# Altium schematic sheet main_stack_dual_channel.SchDoc
size A
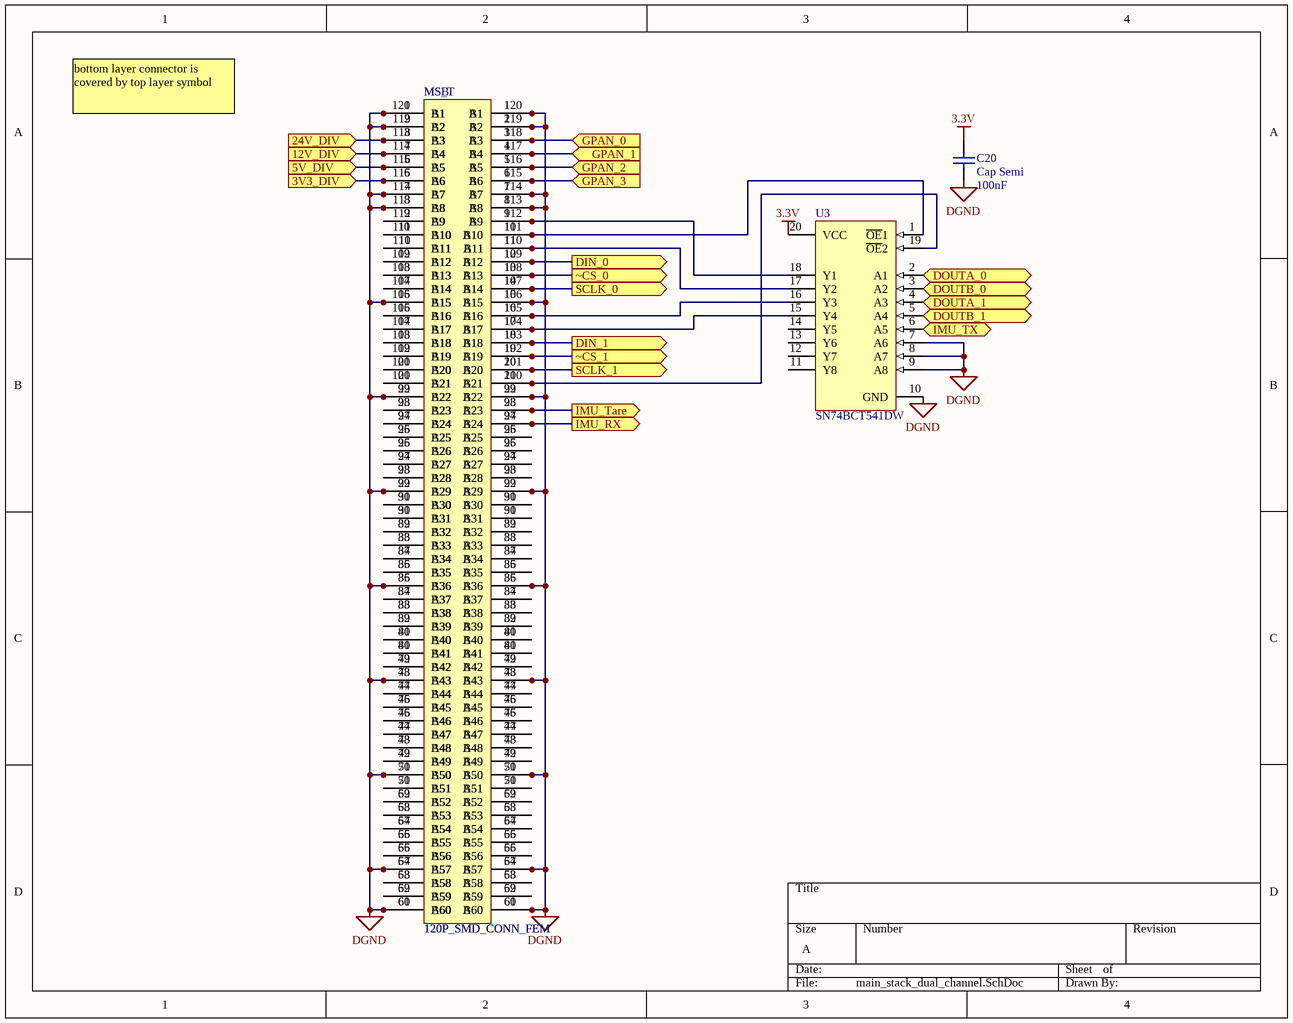
[diagram p0: main_stack_dual_channel.SchDoc]

## Parts
C20  Cap Semi  value 100nF  [C0805]
MS_T  120P_SMD_CONN_FEM  [FX2-120P-1.27SV]
MSB  120P_SMD_CONN_FEM  [FX2-120P-1.27SV]
U3  SN74BCT541DW  [DW020]

## Ports
3V3_DIV (in), 5V_DIV (in), 12V_DIV (in), 24V_DIV (in), DIN_0 (out), DIN_1 (out), DOUTA_0 (in), DOUTA_1 (in), DOUTB_0 (in), DOUTB_1 (in), GPAN_0 (in), GPAN_1 (in), GPAN_2 (in), GPAN_3 (in), IMU_RX (out), IMU_Tare (out), IMU_TX (in), SCLK_0 (out), SCLK_1 (out), ~CS_0 (out), ~CS_1 (out)

## Nets
3.3V: C20.2 U3.20(VCC)
DGND: C20.1 MS_T.1(A1) MS_T.2(A2) MS_T.7(A7) MS_T.8(A8) MS_T.15(A15) MS_T.22(A22) MS_T.29(A29) MS_T.36(A36) MS_T.43(A43) MS_T.50(A50) MS_T.57(A57) MS_T.60(A60) MS_T.61(B60) MS_T.64(B57) MS_T.71(B50) MS_T.78(B43) MS_T.85(B36) MS_T.92(B29) MS_T.99(B22) MS_T.106(B15) MS_T.113(B8) MS_T.114(B7) MS_T.119(B2) MS_T.120(B1) MSB.1(A1) MSB.2(A2) MSB.7(A7) MSB.8(A8) MSB.15(A15) MSB.22(A22) MSB.29(A29) MSB.36(A36) MSB.43(A43) MSB.50(A50) MSB.57(A57) MSB.60(A60) MSB.61(B60) MSB.64(B57) MSB.71(B50) MSB.78(B43) MSB.85(B36) MSB.92(B29) MSB.99(B22) MSB.106(B15) MSB.113(B8) MSB.114(B7) MSB.119(B2) MSB.120(B1) U3.7(A6) U3.8(A7) U3.9(A8) U3.10(GND)
3V3_DIV: MS_T.6(A6) MSB.115(B6) ; port 3V3_DIV
5V_DIV: MS_T.5(A5) MSB.116(B5) ; port 5V_DIV
12V_DIV: MS_T.4(A4) MSB.117(B4) ; port 12V_DIV
24V_DIV: MS_T.3(A3) MSB.118(B3) ; port 24V_DIV
DIN_0: MS_T.109(B12) MSB.12(A12) ; port DIN_0
DIN_1: MS_T.103(B18) MSB.18(A18) ; port DIN_1
DOUTA_0: U3.2(A1) ; port DOUTA_0
DOUTA_1: U3.4(A3) ; port DOUTA_1
DOUTB_0: U3.3(A2) ; port DOUTB_0
DOUTB_1: U3.5(A4) ; port DOUTB_1
GPAN_0: MS_T.118(B3) MSB.3(A3) ; port GPAN_0
GPAN_1: MS_T.117(B4) MSB.4(A4) ; port GPAN_1
GPAN_2: MS_T.116(B5) MSB.5(A5) ; port GPAN_2
GPAN_3: MS_T.115(B6) MSB.6(A6) ; port GPAN_3
IMU_RX: MS_T.97(B24) MSB.24(A24) ; port IMU_RX
IMU_Tare: MS_T.98(B23) MSB.23(A23) ; port IMU_Tare
IMU_TX: U3.6(A5) ; port IMU_TX
SCLK_0: MS_T.107(B14) MSB.14(A14) ; port SCLK_0
SCLK_1: MS_T.101(B20) MSB.20(A20) ; port SCLK_1
~CS_0: MS_T.108(B13) MSB.13(A13) ; port ~CS_0
~CS_1: MS_T.102(B19) MSB.19(A19) ; port ~CS_1
NetMS_T_9: MS_T.9(A9) MSB.112(B9)
NetMS_T_10: MS_T.10(A10) MSB.111(B10)
NetMS_T_11: MS_T.11(A11) MSB.110(B11)
NetMS_T_12: MS_T.12(A12) MSB.109(B12)
NetMS_T_13: MS_T.13(A13) MSB.108(B13)
NetMS_T_14: MS_T.14(A14) MSB.107(B14)
NetMS_T_16: MS_T.16(A16) MSB.105(B16)
NetMS_T_17: MS_T.17(A17) MSB.104(B17)
NetMS_T_18: MS_T.18(A18) MSB.103(B18)
NetMS_T_19: MS_T.19(A19) MSB.102(B19)
NetMS_T_20: MS_T.20(A20) MSB.101(B20)
NetMS_T_21: MS_T.21(A21) MSB.100(B21)
NetMS_T_23: MS_T.23(A23) MSB.98(B23)
NetMS_T_24: MS_T.24(A24) MSB.97(B24)
NetMS_T_25: MS_T.25(A25) MSB.96(B25)
NetMS_T_26: MS_T.26(A26) MSB.95(B26)
NetMS_T_27: MS_T.27(A27) MSB.94(B27)
NetMS_T_28: MS_T.28(A28) MSB.93(B28)
NetMS_T_30: MS_T.30(A30) MSB.91(B30)
NetMS_T_31: MS_T.31(A31) MSB.90(B31)
NetMS_T_32: MS_T.32(A32) MSB.89(B32)
NetMS_T_33: MS_T.33(A33) MSB.88(B33)
NetMS_T_34: MS_T.34(A34) MSB.87(B34)
NetMS_T_35: MS_T.35(A35) MSB.86(B35)
NetMS_T_37: MS_T.37(A37) MSB.84(B37)
NetMS_T_38: MS_T.38(A38) MSB.83(B38)
NetMS_T_39: MS_T.39(A39) MSB.82(B39)
NetMS_T_40: MS_T.40(A40) MSB.81(B40)
NetMS_T_41: MS_T.41(A41) MSB.80(B41)
NetMS_T_42: MS_T.42(A42) MSB.79(B42)
NetMS_T_44: MS_T.44(A44) MSB.77(B44)
NetMS_T_45: MS_T.45(A45) MSB.76(B45)
NetMS_T_46: MS_T.46(A46) MSB.75(B46)
NetMS_T_47: MS_T.47(A47) MSB.74(B47)
NetMS_T_48: MS_T.48(A48) MSB.73(B48)
NetMS_T_49: MS_T.49(A49) MSB.72(B49)
NetMS_T_51: MS_T.51(A51) MSB.70(B51)
NetMS_T_52: MS_T.52(A52) MSB.69(B52)
NetMS_T_53: MS_T.53(A53) MSB.68(B53)
NetMS_T_54: MS_T.54(A54) MSB.67(B54)
NetMS_T_55: MS_T.55(A55) MSB.66(B55)
NetMS_T_56: MS_T.56(A56) MSB.65(B56)
NetMS_T_58: MS_T.58(A58) MSB.63(B58)
NetMS_T_59: MS_T.59(A59) MSB.62(B59)
NetMS_T_62: MS_T.62(B59) MSB.59(A59)
NetMS_T_63: MS_T.63(B58) MSB.58(A58)
NetMS_T_65: MS_T.65(B56) MSB.56(A56)
NetMS_T_66: MS_T.66(B55) MSB.55(A55)
NetMS_T_67: MS_T.67(B54) MSB.54(A54)
NetMS_T_68: MS_T.68(B53) MSB.53(A53)
NetMS_T_69: MS_T.69(B52) MSB.52(A52)
NetMS_T_70: MS_T.70(B51) MSB.51(A51)
NetMS_T_72: MS_T.72(B49) MSB.49(A49)
NetMS_T_73: MS_T.73(B48) MSB.48(A48)
NetMS_T_74: MS_T.74(B47) MSB.47(A47)
NetMS_T_75: MS_T.75(B46) MSB.46(A46)
NetMS_T_76: MS_T.76(B45) MSB.45(A45)
NetMS_T_77: MS_T.77(B44) MSB.44(A44)
NetMS_T_79: MS_T.79(B42) MSB.42(A42)
NetMS_T_80: MS_T.80(B41) MSB.41(A41)
NetMS_T_81: MS_T.81(B40) MSB.40(A40)
NetMS_T_82: MS_T.82(B39) MSB.39(A39)
NetMS_T_83: MS_T.83(B38) MSB.38(A38)
NetMS_T_84: MS_T.84(B37) MSB.37(A37)
NetMS_T_86: MS_T.86(B35) MSB.35(A35)
NetMS_T_87: MS_T.87(B34) MSB.34(A34)
NetMS_T_88: MS_T.88(B33) MSB.33(A33)
NetMS_T_89: MS_T.89(B32) MSB.32(A32)
NetMS_T_90: MS_T.90(B31) MSB.31(A31)
NetMS_T_91: MS_T.91(B30) MSB.30(A30)
NetMS_T_93: MS_T.93(B28) MSB.28(A28)
NetMS_T_94: MS_T.94(B27) MSB.27(A27)
NetMS_T_95: MS_T.95(B26) MSB.26(A26)
NetMS_T_96: MS_T.96(B25) MSB.25(A25)
NetMS_T_100: MS_T.100(B21) MSB.21(A21) U3.19(~{OE}2)
NetMS_T_104: MS_T.104(B17) MSB.17(A17) U3.15(Y4)
NetMS_T_105: MS_T.105(B16) MSB.16(A16) U3.16(Y3)
NetMS_T_110: MS_T.110(B11) MSB.11(A11) U3.17(Y2)
NetMS_T_111: MS_T.111(B10) MSB.10(A10) U3.1(~{OE}1)
NetMS_T_112: MS_T.112(B9) MSB.9(A9) U3.18(Y1)

Not connected (* = marked no-connect by the designer): U3 11(Y8) 12(Y7) 13(Y6) 14(Y5)

## Notes on the sheet
- bottom layer connector is covered by top layer symbol

## Library data of the parts
C20 = Cap Semi: Capacitor (Semiconductor SIM Model); Published: 8-Jun-2000; LatestRevisionDate: 29-May-2009; LatestRevisionNote: IPC-7351 Footprint Added.; PackageReference: C1206; Publisher: Altium Limited; PackageDescription: Chip Capacitor
MS_T MSB = 120P_SMD_CONN_FEM: Main Stack Connector, Female; Part Number: FX2-120P-1.27SV(71)
  MSB: Datasheet: http://www.hirose.co.jp/cataloge_hp/e57220088.pdf
U3 = SN74BCT541DW: Octal Buffer/Driver with 3-State Outputs; ComponentAvailability: Obsolete; Published: 8-Jun-2000; LatestRevisionDate: 13-Apr-2006; LatestRevisionNote: IPC-7351 Footprint Added.; DatasheetVersion: Apr-1994; PackageVersion: Mar-2000; PackageReference: DW020; Publisher: Altium Limited; PackageDescription: 20-Pin Plastic Small Outline Integrated Circuit 1.27 mm Pitch; Code_JEDEC: MS-013; Code_IPC: SOIC127P1030-20; ComponentLink1Description: Manufacturer Link; ComponentLink1URL: http://www.ti.com/; ComponentLink2Description: Discontinuation Notice; ComponentLink2URL: http://focus.ti.com/docs/prod/folders/print/sn74bct541.html; Datasheet: http://www.ti.com/lit/ds/symlink/sn74bct541a.pdf; Digikey PN: 296-33840-5-ND